# Altium schematic sheet Main.SchDoc
size A
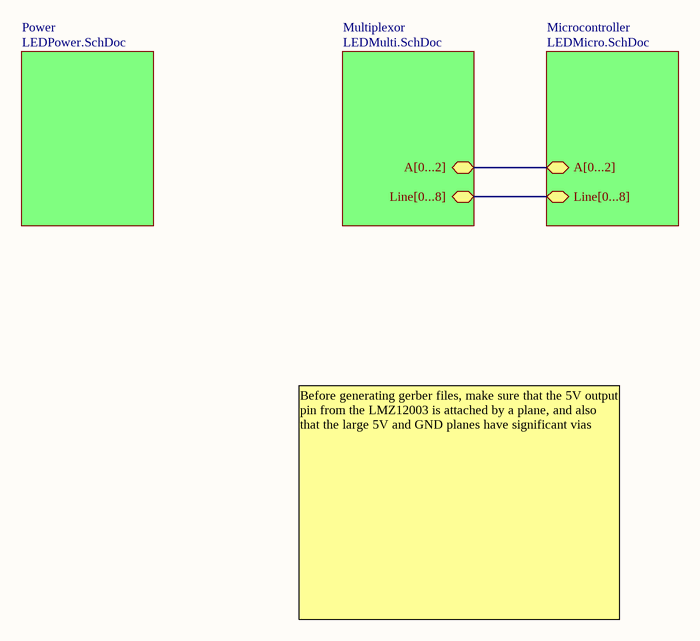
[diagram p0: Main.SchDoc]

## Sub-sheets
Microcontroller = LEDMicro.SchDoc: Line[0...8], A[0...2]
Multiplexor = LEDMulti.SchDoc: Line[0...8], A[0...2]
Power = LEDPower.SchDoc: no entries

## Buses and harness runs
bus sheet Microcontroller/A[0...2] = sheet Multiplexor/A[0...2]
bus sheet Microcontroller/Line[0...8] = sheet Multiplexor/Line[0...8]

## Notes on the sheet
- Before generating gerber files, make sure that the 5V output pin from the LMZ12003 is attached by a plane, and also that the large 5V and GND planes have significant vias